# EAGLE design Schematic (EAGLE 9.6.2)
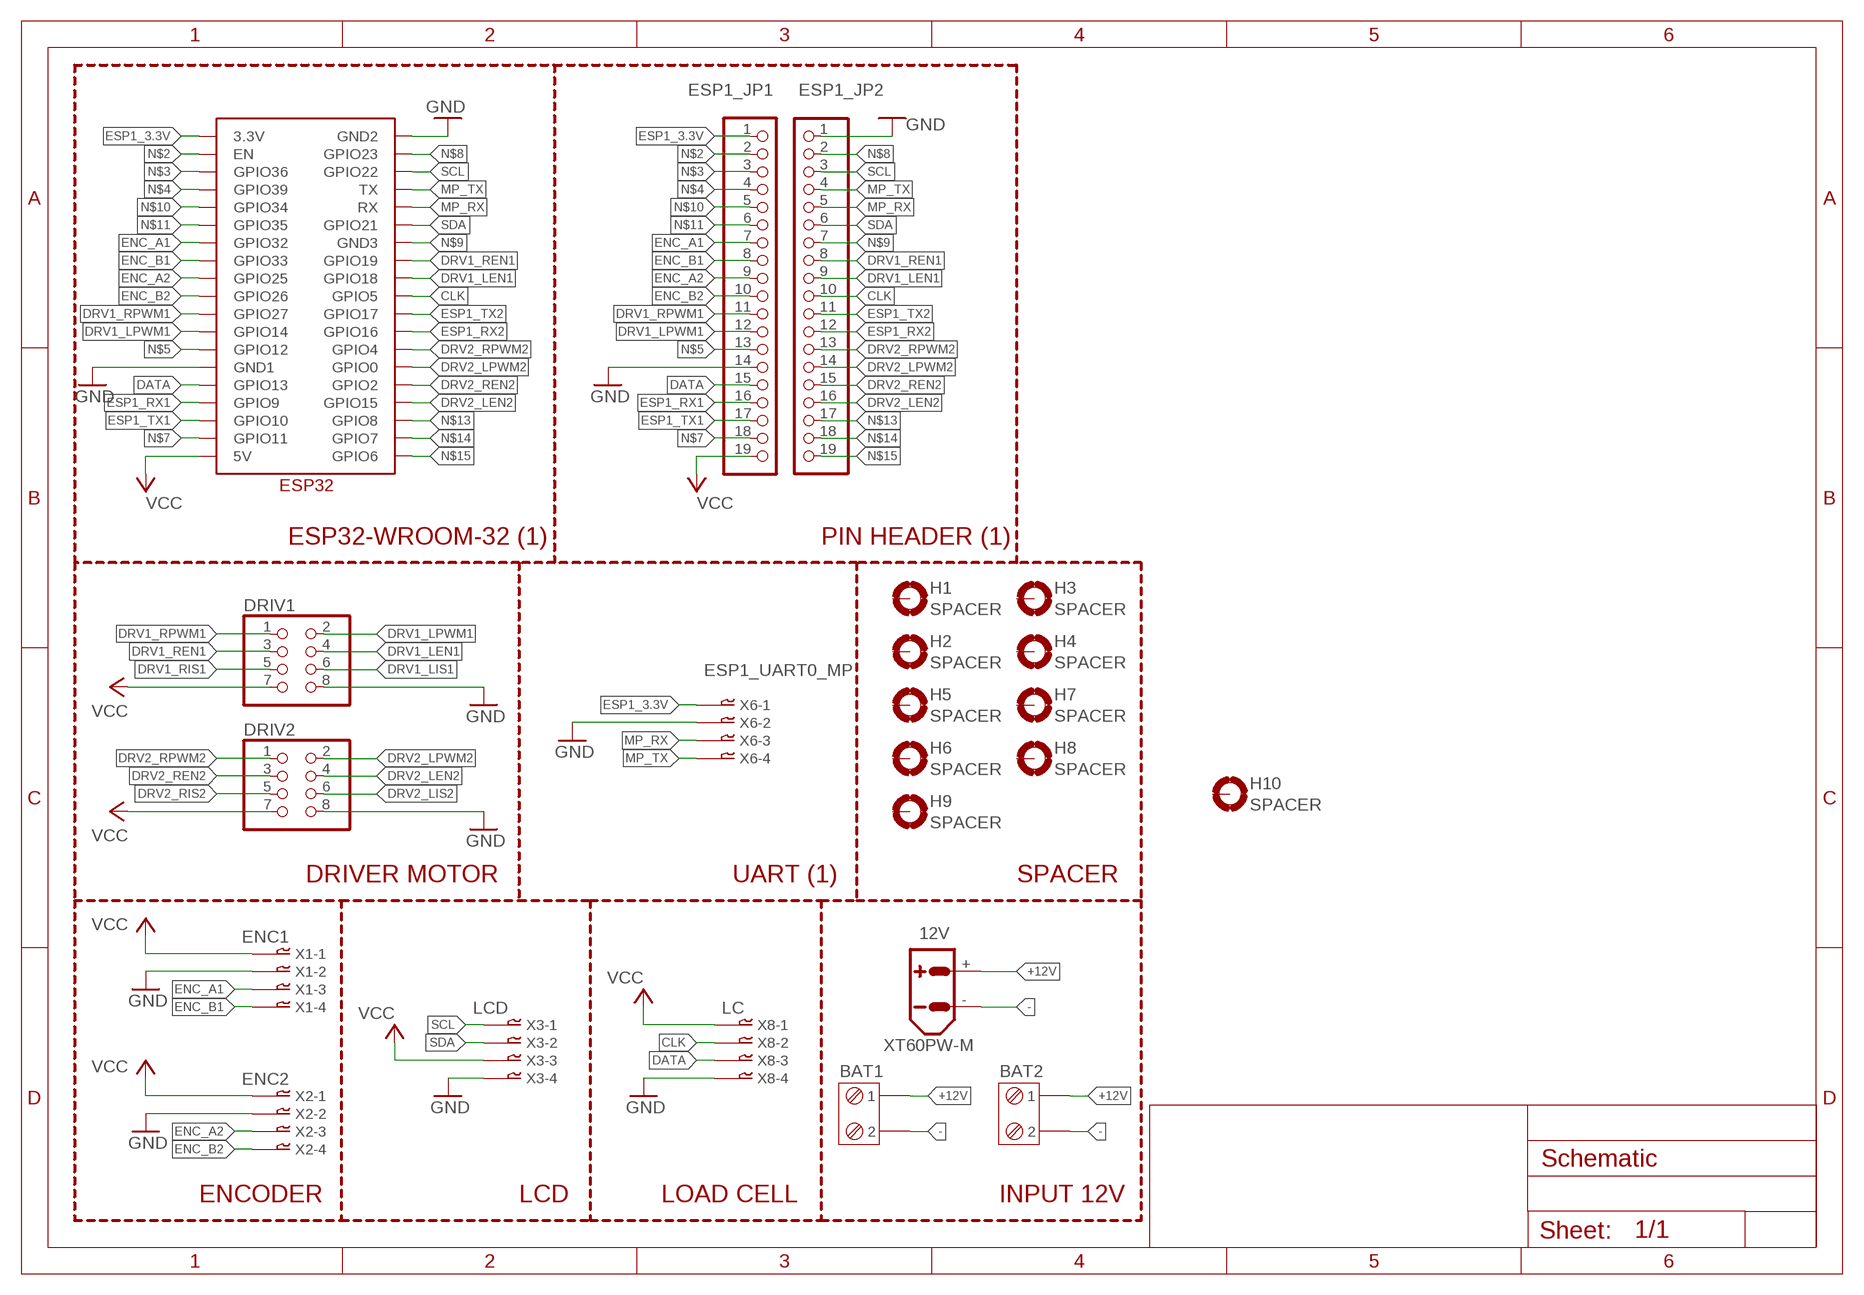
[diagram p0: schematic, sheet 1]

## Parts
12V  XT60PW-M  [XT60PW-M]
BAT1  TERMINAL-BLOK-2P  [TERMINAL_BLOK_2P]
BAT2  TERMINAL-BLOK-2P  [TERMINAL_BLOK_2P]
DRIV1  PINHD-2X4  [2X04]
DRIV2  PINHD-2X4  [2X04]
ESP1_JP1  PINHD-1X19  [1X19]
ESP1_JP2  PINHD-1X19  [1X19]
H1  SPACER  [3,0-PAD]
H2  SPACER  [3,0-PAD]
H3  SPACER  [3,0-PAD]
H4  SPACER  [3,0-PAD]
H5  SPACER  [3,0-PAD]
H6  SPACER  [3,0-PAD]
H7  SPACER  [3,0-PAD]
H8  SPACER  [3,0-PAD]
H9  SPACER  [3,0-PAD]
H10  SPACER  [3,0-PAD]
U$1  ESP32_GRBL  [ESP32_GRBL]
X1  ENC1  04-JST-B4B-XH-A  [B4B-XH]
X2  ENC2  04-JST-B4B-XH-A  [B4B-XH]
X3  LCD  04-JST-B4B-XH-A  [B4B-XH]
X6  ESP1_UART0_MP  04-JST-B4B-XH-A  [B4B-XH]
X8  LC  04-JST-B4B-XH-A  [B4B-XH]

## Nets
+12V: 12V.+ BAT1.1 BAT2.1
-: 12V.- BAT1.2 BAT2.2
CLK: ESP1_JP2.10 U$1.GPIO5 X8.P$2
DATA: ESP1_JP1.15 U$1.GPIO13 X8.P$3
DRV1_LEN1: DRIV1.4 ESP1_JP2.9 U$1.GPIO18
DRV1_LIS1: DRIV1.6
DRV1_LPWM1: DRIV1.2 ESP1_JP1.12 U$1.GPIO14
DRV1_REN1: DRIV1.3 ESP1_JP2.8 U$1.GPIO19
DRV1_RIS1: DRIV1.5
DRV1_RPWM1: DRIV1.1 ESP1_JP1.11 U$1.GPIO27
DRV2_LEN2: DRIV2.4 ESP1_JP2.16 U$1.GPIO15
DRV2_LIS2: DRIV2.6
DRV2_LPWM2: DRIV2.2 ESP1_JP2.14 U$1.GPIO0
DRV2_REN2: DRIV2.3 ESP1_JP2.15 U$1.GPIO2
DRV2_RIS2: DRIV2.5
DRV2_RPWM2: DRIV2.1 ESP1_JP2.13 U$1.GPIO4
ENC_A1: ESP1_JP1.7 U$1.GPIO32 X1.P$3
ENC_A2: ESP1_JP1.9 U$1.GPIO25 X2.P$3
ENC_B1: ESP1_JP1.8 U$1.GPIO33 X1.P$4
ENC_B2: ESP1_JP1.10 U$1.GPIO26 X2.P$4
ESP1_3.3V: ESP1_JP1.1 U$1.3.3V X6.P$1
ESP1_RX1: ESP1_JP1.16 U$1.GPIO9
ESP1_RX2: ESP1_JP2.12 U$1.GPIO16
ESP1_TX1: ESP1_JP1.17 U$1.GPIO10
ESP1_TX2: ESP1_JP2.11 U$1.GPIO17
GND: DRIV1.8 DRIV2.8 ESP1_JP1.14 ESP1_JP2.1 U$1.GND1 U$1.GND2 X1.P$2 X2.P$2 X3.P$4 X6.P$2 X8.P$4
MP_RX: ESP1_JP2.5 U$1.RX X6.P$3
MP_TX: ESP1_JP2.4 U$1.TX X6.P$4
N$2: ESP1_JP1.2 U$1.EN
N$3: ESP1_JP1.3 U$1.GPIO36
N$4: ESP1_JP1.4 U$1.GPIO39
N$5: ESP1_JP1.13 U$1.GPIO12
N$7: ESP1_JP1.18 U$1.GPIO11
N$8: ESP1_JP2.2 U$1.GPIO23
N$9: ESP1_JP2.7 U$1.GND3
N$10: ESP1_JP1.5 U$1.GPIO34
N$11: ESP1_JP1.6 U$1.GPIO35
N$13: ESP1_JP2.17 U$1.GPIO8
N$14: ESP1_JP2.18 U$1.GPIO7
N$15: ESP1_JP2.19 U$1.GPIO6
SCL: ESP1_JP2.3 U$1.GPIO22 X3.P$1
SDA: ESP1_JP2.6 U$1.GPIO21 X3.P$2
VCC: DRIV1.7 DRIV2.7 ESP1_JP1.19 U$1.5V X1.P$1 X2.P$1 X3.P$3 X8.P$1
Unconnected: H1.B3,0(MOUNT) H2.B3,0(MOUNT) H3.B3,0(MOUNT) H4.B3,0(MOUNT) H5.B3,0(MOUNT) H6.B3,0(MOUNT) H7.B3,0(MOUNT) H8.B3,0(MOUNT) H9.B3,0(MOUNT) H10.B3,0(MOUNT)

## Notes on the sheet
- ESP32-WROOM-32 (1) | PIN HEADER (1)
- DRIVER MOTOR | UART (1) | SPACER
- ENCODER | LCD | LOAD CELL | INPUT 12V

## Library data of the parts
12V = 00-XT:XT60: AMASS XT60 connector Store in Japan AMASS XT60 connector <https://szc.jp/ams-xt60>
BAT1 BAT2 = 00-LIBRARY LKS OK:TERMINAL-BLOK-2P
DRIV1 DRIV2 = pinhead:PINHD-2X4: PIN HEADER
ESP1_JP1 ESP1_JP2 = pinhead:PINHD-1X19: PIN HEADER
H1-H10 = 00-LIBRARY LKS OK:SPACER: MOUNTING PAD, round
U$1 = 00-ESP32:ESP32_GRBL
X1-X3 X6 X8 = 00-bt_con-jst-xh:04-JST: JST CONNECTOR

## Board
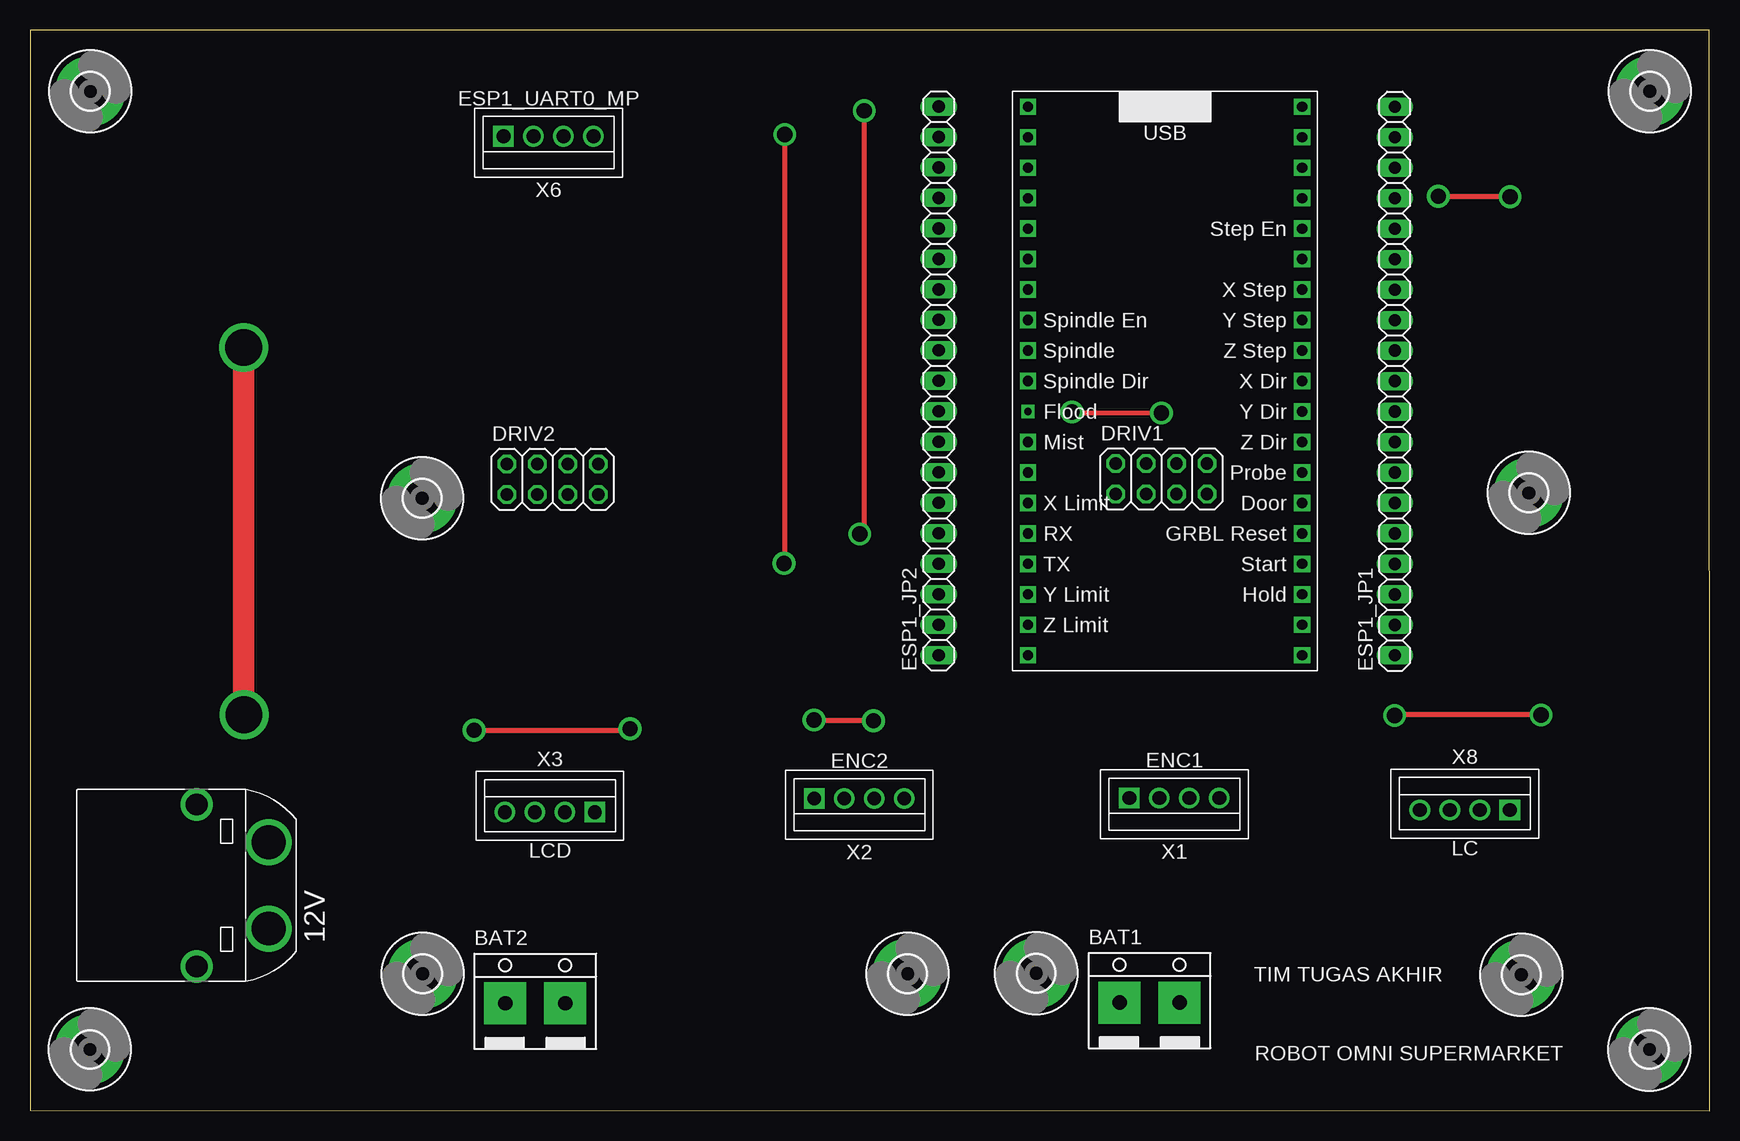
[diagram p1: board, top side]
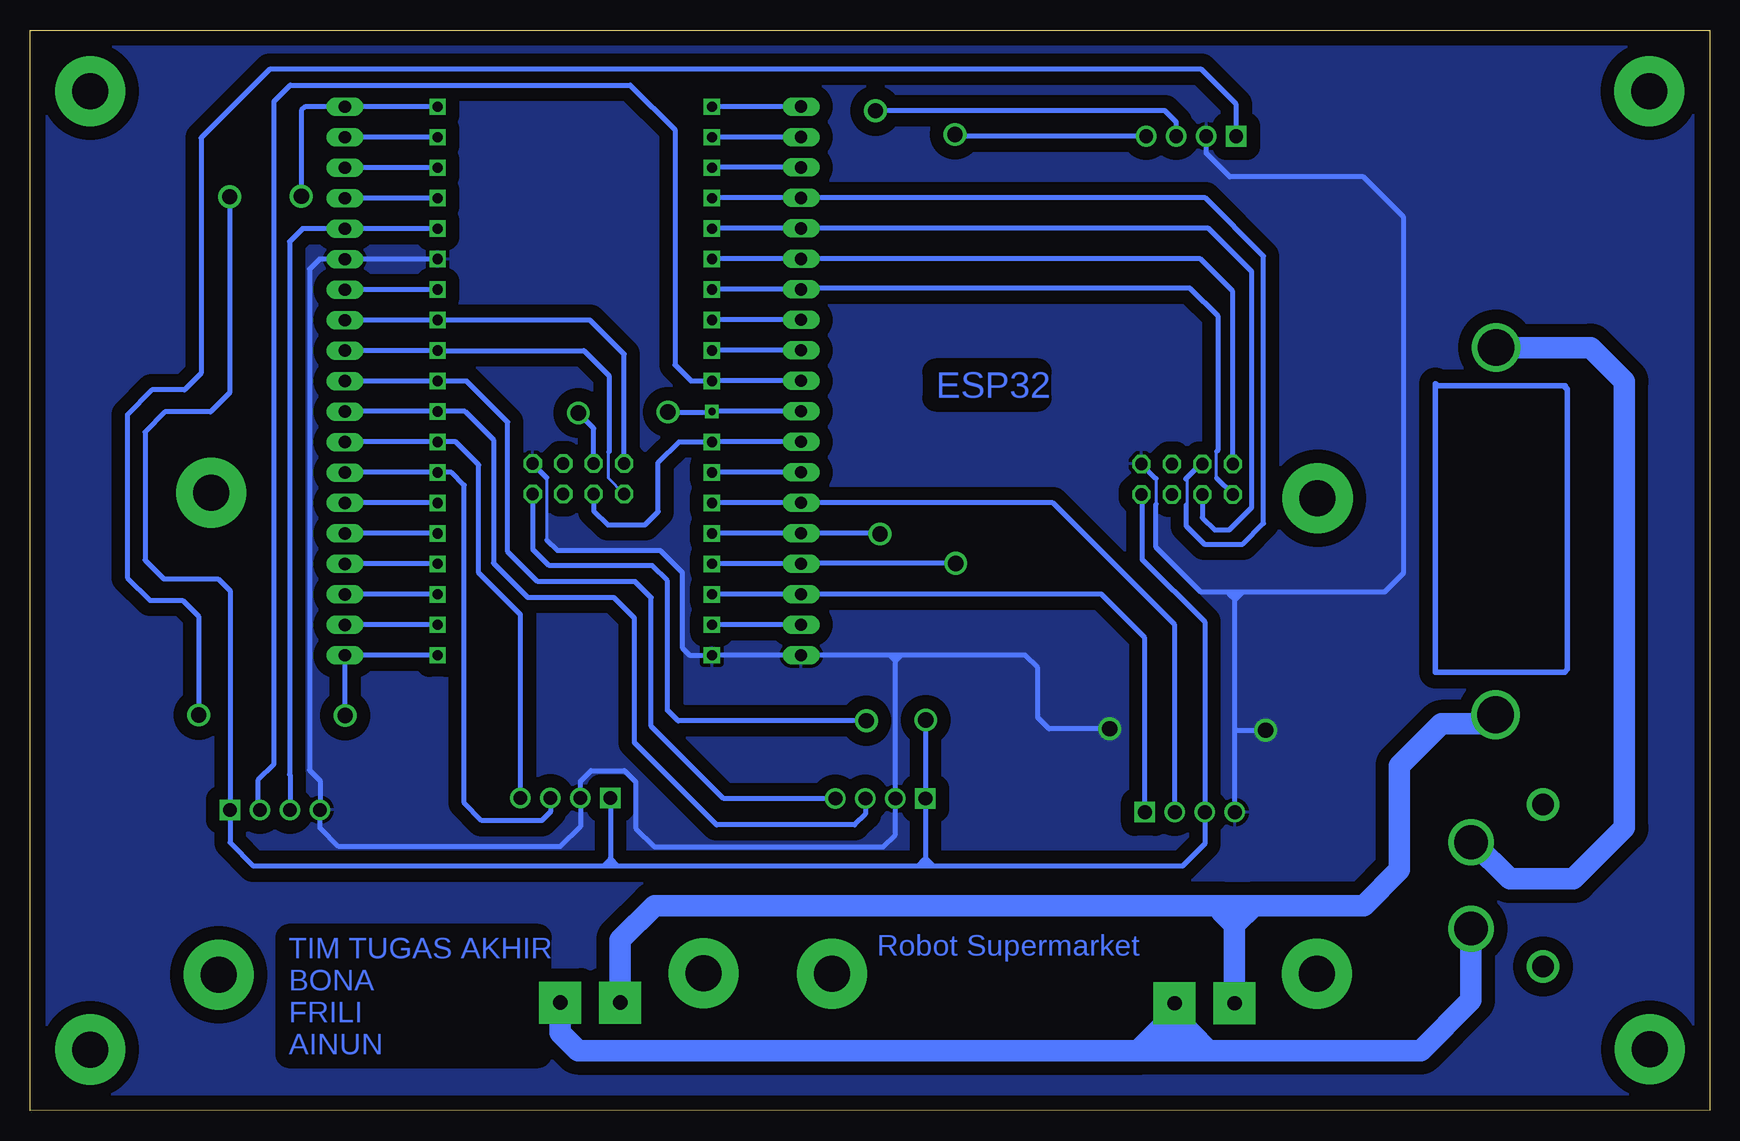
[diagram p2: board, bottom side, seen from below]

Size 140.02 x 90.05 mm. Coordinates in mm from the lower left corner, seen from the top.
Outline: 0,0.02 140.02,0 140,90.05 0.01,90.01 0,0.02
Copper layers (1*16): Top 0.035mm / dielectric 1.5mm / Bottom 0.035mm
Design rules "default *": minimum track width 8mil, minimum drill 16mil, track to track 6mil, track to pad 6mil, pad to pad 6mil, via to via 6mil, smd to smd 6mil, copper to edge 50mil, drill to drill 30mil, minimum pad ring 10mil, minimum via ring 8mil, stop-mask expansion 4mil, vias tented up to drill 0mil, thermal gap 12mil

### Footprints (pad centres in the part's own frame; a part is rotated, then mirrored left to right if it is on the bottom)
XT60PW-M = drill 2.8: + 3.6,0; - -3.6,0 | drill 1.8: P$3 -6.75,6; P$4 6.75,6
TERMINAL_BLOK_2P = drill 1.194 pad 3.5 square: 1 -2.5,0; 2 2.5,0
2X04 = drill 1.016 octagon: 1 -3.81,-1.27; 2 -3.81,1.27; 3 -1.27,-1.27; 4 -1.27,1.27; 5 1.27,-1.27; 6 1.27,1.27; 7 3.81,-1.27; 8 3.81,1.27
1X19 = drill 1.016 long: 1 -22.86,0; 2 -20.32,0; 3 -17.78,0; 4 -15.24,0; 5 -12.7,0; 6 -10.16,0; 7 -7.62,0; 8 -5.08,0; 9 -2.54,0; 10 0,0; 11 2.54,0; 12 5.08,0; 13 7.62,0; 14 10.16,0; 15 12.7,0; 16 15.24,0; 17 17.78,0; 18 20.32,0; 19 22.86,0
3,0-PAD = drill 3 pad 5.842: B3,0 0,0
ESP32_GRBL = drill 0.85 square: 3.3V 1.27,46.99; 5V 1.27,1.27; EN 1.27,44.45; GND1 1.27,13.97; GND2 24.13,46.99; GND3 24.13,31.75; GPIO0 24.13,13.97; GPIO2 24.13,11.43; GPIO4 24.13,16.51; GPIO5 24.13,24.13; GPIO6 24.13,1.27; GPIO7 24.13,3.81; GPIO8 24.13,6.35; GPIO9 1.27,8.89; GPIO10 1.27,6.35; GPIO11 1.27,3.81; GPIO12 1.27,16.51; GPIO13 1.27,11.43; GPIO14 1.27,19.05; GPIO15 24.13,8.89; GPIO16 24.13,19.05; GPIO17 24.13,21.59; GPIO19 24.13,29.21; GPIO21 24.13,34.29; GPIO22 24.13,41.91; GPIO23 24.13,44.45; GPIO25 1.27,26.67; GPIO26 1.27,24.13; GPIO27 1.27,21.59; GPIO32 1.27,31.75; GPIO33 1.27,29.21; GPIO34 1.27,36.83; GPIO35 1.27,34.29; GPIO36 1.27,41.91; GPIO39 1.27,39.37; RX 24.13,36.83; TX 24.13,39.37 | drill 0.6 square: GPIO18 24.13,26.67
B4B-XH = drill 1.143 square: P$1 3.75,0 | drill 1.143: P$2 1.25,0; P$3 -1.25,0; P$4 -3.75,0

### Placement (x,y rotation side)
12V  19.9,18.76 90 top
BAT1  93.32,9 0 top
BAT2  42.12,8.94 0 top
DRIV1  94.31,52.65 0 top
DRIV2  43.57,52.61 0 top
ESP1_JP1  113.77,60.79 90 top
ESP1_JP2  75.74,60.81 90 top
H1  4.99,5.09 0 top
H2  135.01,84.95 0 top
H3  134.99,5.09 0 top
H4  5.03,84.93 0 top
H5  83.88,11.45 0 top
H6  32.74,11.39 0 top
H7  124.3,11.33 0 top
H8  73.16,11.39 0 top
H9  124.93,51.47 0 top
H10  32.69,51.03 0 top
U$1  107.31,84.92 180 top
X1  95.39,26.04 180 top
X2  69.13,26 180 top
X3  43.34,24.86 0 top
X6  43.23,81.19 180 top
X8  119.61,25.05 0 top

### Tracks (layer width: path | path; a pad name or v marks a point on that pad's centre or on a via)
+12V  (via drill 3.05)
  Top 1.778: v17.81,63.58 17.81,33.02 v17.85,32.98
  Bottom 1.778: 39.62,15.47 BAT2.1 | 38,17.08 39.62,15.47 | 40.72,17.08 38,17.08 | 40.72,17.08 87.98,17.08 90.83,14.24 BAT1.1 | 39.62,15.47 40.72,16.57 40.72,17.08 | 12V.+ 19.74,22.36 16.67,19.3 11.38,19.3 7.11,23.56 7.11,60.76 9.93,63.58 v17.81,63.58 | v17.85,32.98 18.6,32.23 22.36,32.23 25.86,28.74 25.86,20.07 28.85,17.08 38,17.08
-
  Bottom 1.778: 41.77,5 44.05,5 | 44.62,8.03 44.62,7.85 43.27,6.5 | 44.05,5 44.27,5.22 44.62,5.22 | 44.05,5 47.32,5 | 47.32,5 94.35,5 95.83,6.48 BAT1.2 | 41.77,5 43.27,6.5 | 44.62,8.03 BAT2.2 | 47.32,5 47.32,5.33 46.15,6.5 | 46.15,6.5 44.62,8.03 | 43.27,6.5 46.15,6.5 | 12V.- 19.9,9.2 24.09,5 41.77,5
CLK
  Bottom 0.406: ESP1_JP2.10 83.17,60.81 | 83.17,60.81 U$1.GPIO5 | 83.17,60.81 84.93,60.81 86.26,62.13 86.26,81.74 89.98,85.46 118.32,85.46 119.69,84.1 119.69,28.87 121.04,27.52 121.04,25.24 X8.P$2
DATA
  Bottom 0.406: U$1.GPIO13 ESP1_JP1.15 117.31,73.49 118.39,72.41 118.39,28.02 118.36,27.99 X8.P$3
DRV1_LEN1  (via drill 1.27 pad 0.6)
  Top 0.406: v94.31,58.13 86.93,58.13 v86.85,58.21
  Bottom 0.406: ESP1_JP2.9 83.17,58.27 U$1.GPIO18 83.22,58.21 v86.85,58.21 | DRIV1.4 93.03,56.85 v94.31,58.13
DRV1_LPWM1
  Bottom 0.406: ESP1_JP1.12 106.44,65.88 U$1.GPIO14 93.34,65.88 90.5,63.03 DRIV1.2
DRV1_REN1
  Bottom 0.406: ESP1_JP2.8 82.91,55.73 83.17,55.73 | 83.17,55.73 U$1.GPIO19 | DRIV1.3 93.03,49.98 91.85,48.8 88.76,48.8 87.65,49.9 87.65,54.01 85.94,55.73 83.17,55.73
DRV1_RPWM1
  Bottom 0.254: 91.76,54.88 91.83,54.81 91.83,52.71 DRIV1.1
  Bottom 0.406: ESP1_JP1.11 U$1.GPIO27 93.84,63.34 91.76,61.25 91.76,54.88
DRV2_LEN2
  Bottom 0.254: 43.63,50.46 43.6,50.49 43.6,52.58 43.67,52.65
  Bottom 0.406: U$1.GPIO15 83.17,76.05 ESP1_JP2.16 42.05,76.05 37.2,71.2 37.2,48.93 38.93,47.2 42.13,47.2 43.63,48.69 43.63,50.46 | 43.67,52.65 42.44,53.88 DRIV2.4
DRV2_LPWM2
  Bottom 0.406: U$1.GPIO0 83.17,70.97 ESP1_JP2.14 42.47,70.97 39.76,68.26 DRIV2.2
DRV2_REN2
  Bottom 0.406: U$1.GPIO2 83.17,73.51 ESP1_JP2.15 41.78,73.51 38.19,69.91 38.19,50.26 40.06,48.39 41.27,48.39 42.3,49.42 DRIV2.3
DRV2_RPWM2
  Bottom 0.254: 41.12,52.71 41.12,54.91 41.01,55.02
  Bottom 0.406: ESP1_JP2.13 76.06,68.43 | 76.06,68.43 83.17,68.43 U$1.GPIO4 | DRIV2.1 41.12,52.71 | 76.06,68.43 75.95,68.54 43.34,68.54 41.01,66.21 41.01,55.02 41.11,54.93
ENC_A1
  Bottom 0.406: ESP1_JP1.7 U$1.GPIO32 104.89,53.18 103.83,52.12 103.83,25.63 102.36,24.16 97.37,24.16 96.64,24.89 X1.P$3
ENC_A2
  Bottom 0.406: ESP1_JP1.9 U$1.GPIO25 103.76,58.26 101.39,55.88 101.39,45.61 98.53,42.76 91.36,42.76 89.65,41.05 89.65,30.68 82.78,23.8 71.28,23.8 70.38,24.7 X2.P$3
ENC_B1
  Bottom 0.406: ESP1_JP1.8 U$1.GPIO33 104.53,55.72 102.62,53.8 102.62,44.81 99.14,41.33 X1.P$4
ENC_B2
  Bottom 0.406: ESP1_JP1.10 U$1.GPIO26 103.61,60.8 100.19,57.38 100.19,46.58 97.7,44.09 89.58,44.09 88.25,42.75 88.25,32.04 82.2,26 X2.P$4
ESP1_3.3V  (via drill 1.27 pad 0.6)
  Top 0.406: v125.96,32.97 113.8,32.97 v113.75,32.92
  Bottom 0.406: U$1.3.3V 113.65,37.94 | 113.65,37.94 ESP1_JP1.1 | X6.P$1 39.48,83.86 42.38,86.76 120.05,86.76 125.75,81.06 125.75,61.45 127.14,60.06 129.86,60.06 131.91,58 131.91,44.42 130.01,42.52 127.3,42.52 125.96,41.18 v125.96,32.97 | v113.75,32.92 113.75,37.83 113.65,37.94
ESP1_RX1
  Bottom 0.406: U$1.GPIO9 ESP1_JP1.16
ESP1_RX2
  Bottom 0.406: ESP1_JP2.12 83.17,65.89 U$1.GPIO16
ESP1_TX1
  Bottom 0.406: U$1.GPIO10 ESP1_JP1.17
ESP1_TX2
  Bottom 0.406: ESP1_JP2.11 83.17,63.35 U$1.GPIO17
GND  (via drill 1.27 pad 0.6)
  Top 0.406: v37.02,31.68 49.91,31.68 v50.03,31.81
  Bottom 0.254: 96.94,52.74 96.94,47.54 | 46.15,52.66 46.15,50.54 46.17,50.53
  Bottom 0.406: 83.17,37.95 ESP1_JP2.1 68.34,37.95 | 83.17,37.95 U$1.GND2 | U$1.GND1 ESP1_JP1.14 115.88,70.95 116.72,70.11 116.72,28.37 115.86,27.5 X8.P$4 115.86,23.56 114.28,21.98 95.83,21.98 94.14,23.67 X1.P$2 94.14,27.45 93.26,28.32 90.47,28.32 89.53,27.39 89.53,23.54 87.96,21.97 68.9,21.97 67.88,22.98 X2.P$2 67.88,37.49 | X3.P$4 39.59,31.81 | 46.15,52.66 DRIV2.8 | X6.P$2 41.98,79.77 40.02,77.81 28.88,77.81 25.55,74.49 25.55,44.75 27.11,43.2 38.95,43.2 | DRIV1.8 96.94,52.74 | 83.17,37.95 85.04,37.95 85.66,38.57 85.66,44.85 87.47,46.66 96.06,46.66 96.94,47.54 | 39.59,31.81 39.47,31.68 v37.02,31.68 | v50.03,31.81 55.07,31.81 56.02,32.75 56.02,36.89 57.07,37.95 67.42,37.95 | 67.42,37.95 68.07,37.95 | 68.07,37.95 68.34,37.95 | 68.07,37.95 67.88,37.76 67.88,37.49 | 67.42,37.95 67.88,37.49 | 67.88,37.49 68.34,37.95 | 38.95,43.2 39.74,43.2 | 39.74,43.2 40.07,43.2 | 40.07,43.2 42.41,43.2 46.17,46.95 46.17,50.53 | 39.74,43.2 39.59,43.05 39.59,42.56 | 39.59,31.81 39.59,42.56 | 38.95,43.2 39.59,42.56 | 39.59,42.56 40.07,43.04 40.07,43.2
  pour Bottom (isolate 1.118): 0,90.15 140.01,90.15 140.23,90.37 140.23,-0.2 140.01,-0.42 0,-0.42 -0.22,-0.2 -0.22,89.93 -0.44,90.15
MP_RX  (via drill 1.27 pad 0.6)
  Top 0.406: v69.54,83.32 69.54,48.41 v69.17,48.04
  Bottom 0.406: U$1.RX 83.17,48.11 ESP1_JP2.5 69.24,48.11 v69.17,48.04 | X6.P$3 44.48,82.37 45.43,83.32 v69.54,83.32
MP_TX  (via drill 1.27 pad 0.6)
  Top 0.406: v62.91,81.34 62.91,45.65 v62.86,45.6
  Bottom 0.406: ESP1_JP2.4 75.89,45.57 | 75.89,45.57 83.17,45.57 U$1.TX | X6.P$4 62.76,81.19 v62.91,81.34 | v62.86,45.6 75.86,45.6 75.89,45.57
N$1
  Bottom 0.457: 12.03,60.4 22.71,60.4 22.86,60.55 22.86,36.53 12.11,36.53 11.88,36.76 11.88,60.1 12.11,60.33
N$2
  Bottom 0.406: U$1.EN ESP1_JP1.2
N$3
  Bottom 0.406: U$1.GPIO36 ESP1_JP1.3
N$4
  Bottom 0.406: U$1.GPIO39 ESP1_JP1.4
N$5
  Bottom 0.406: U$1.GPIO12 ESP1_JP1.13
N$7
  Bottom 0.406: U$1.GPIO11 ESP1_JP1.18
N$8
  Bottom 0.406: ESP1_JP2.2 83.17,40.49 U$1.GPIO23
N$9
  Bottom 0.406: ESP1_JP2.7 83.17,53.19 U$1.GND3
N$10
  Bottom 0.406: U$1.GPIO34 ESP1_JP1.5
N$11
  Bottom 0.406: U$1.GPIO35 ESP1_JP1.6
N$13
  Bottom 0.406: ESP1_JP2.17 83.17,78.59 U$1.GPIO8
N$14
  Bottom 0.406: ESP1_JP2.18 83.17,81.13 U$1.GPIO7
N$15
  Bottom 0.406: ESP1_JP2.19 83.17,83.67 U$1.GPIO6
SCL
  Bottom 0.406: U$1.GPIO22 83.17,43.03 ESP1_JP2.3 50.73,43.03 47.09,39.39 X3.P$1
SDA
  Bottom 0.406: U$1.GPIO21 83.17,50.65 ESP1_JP2.6 54.76,50.65 44.59,40.48 X3.P$2
VCC  (via drill 1.27 pad 0.6)
  Top 0.406: v70.31,32.48 65.42,32.48 v65.36,32.54 | v117.4,76.2 123.33,76.2 v123.38,76.15
  Bottom 0.406: U$1.5V 113.07,83.66 113.18,83.77 113.65,83.77 ESP1_JP1.19 117.1,83.65 117.4,83.34 v117.4,76.2 | 64.71,20.37 43.94,20.37 42.09,22.22 X3.P$3 42.09,40.72 47.31,45.94 47.31,51.28 DRIV2.7 | 64.71,20.37 65.35,20.37 | 65.35,20.37 66.06,20.37 | 66.06,20.37 90.98,20.37 | 90.98,20.37 91.62,20.37 | 91.62,20.37 92.23,20.37 | 92.23,20.37 121.41,20.37 123.36,22.32 X8.P$1 123.36,43.33 124.34,44.31 128.87,44.31 130.43,45.87 130.43,56.56 128.77,58.22 124.96,58.22 123.38,59.8 v123.38,76.15 | 65.38,20.94 X2.P$1 65.36,26.02 v65.36,32.54 | 65.38,20.94 65.38,20.4 65.35,20.37 | 64.71,20.37 65.28,20.94 65.38,20.94 | 65.38,20.94 65.49,20.94 66.06,20.37 | X1.P$1 91.64,21.03 | 91.64,20.96 91.64,20.39 91.62,20.37 | 90.98,20.37 91.64,21.03 | 91.64,21.03 91.64,20.96 | 91.64,20.96 92.23,20.37 | DRIV1.7 98.11,46.79 96.74,45.41 88.16,45.41 86.88,44.13 86.88,33.36 86,32.48 v70.31,32.48

### Text on the board
Bottom: ESP32 | Robot Supermarket | TIM TUGAS AKHIR / BONA / FRILI / AINUN
tNames: TIM TUGAS AKHIR | ROBOT OMNI SUPERMARKET